# EAGLE schematic jdrange (EAGLE 9.6.2)
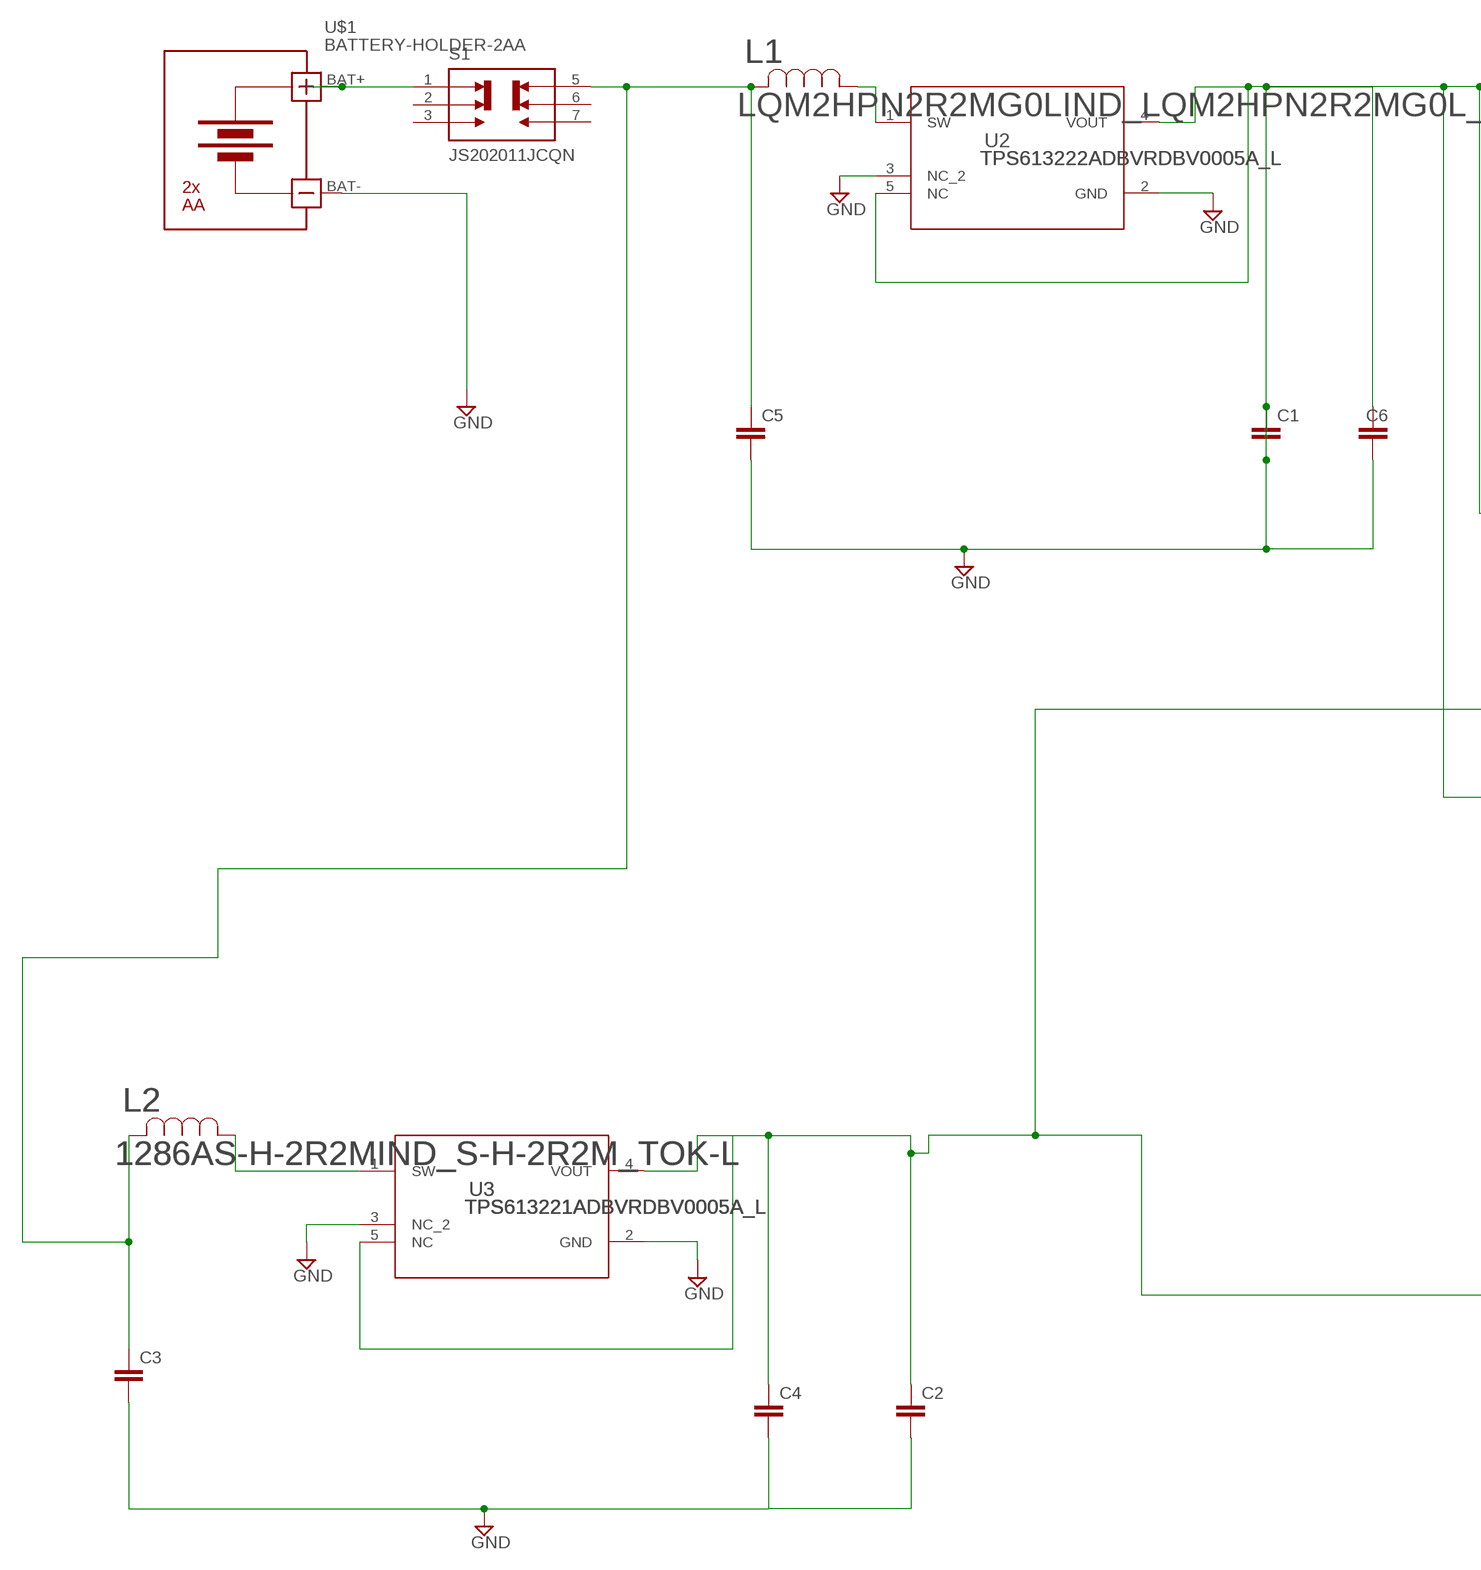
[diagram p0: schematic, sheet 1, part 1 of 2]
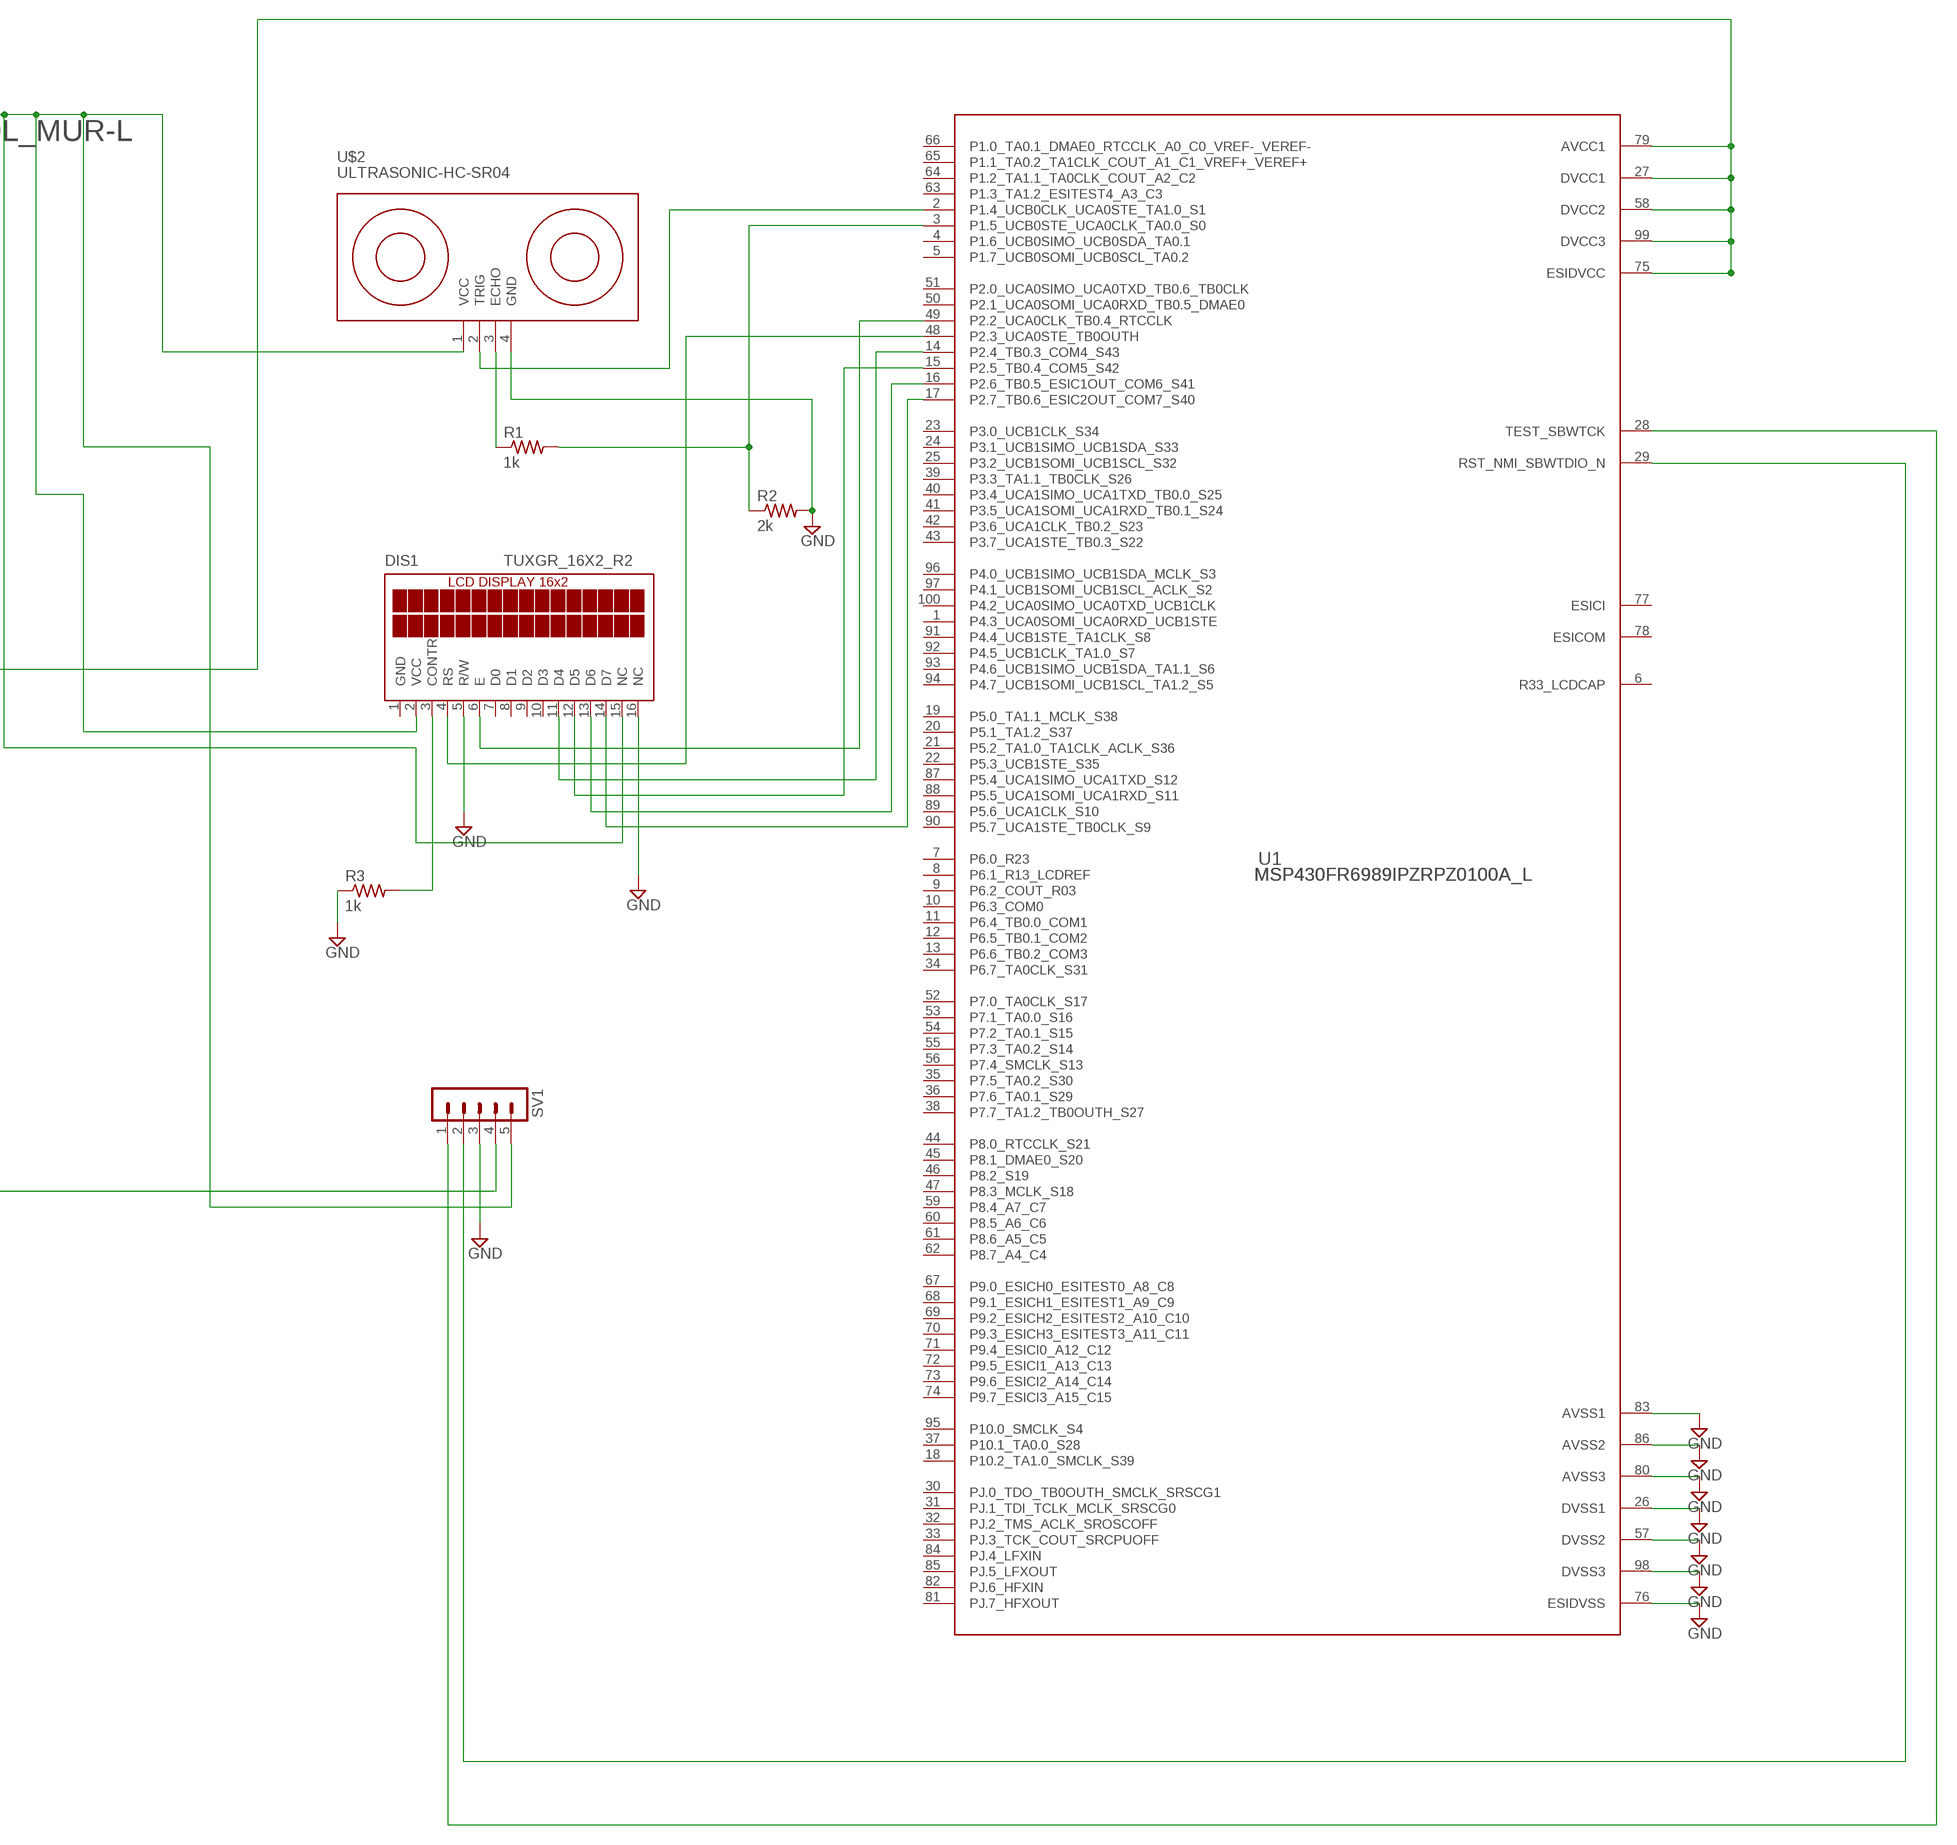
[diagram p1: schematic, sheet 1, part 2 of 2]

## Parts
C1  C-EUC0805  [C0805]
C2  C-EUC0805  [C0805]
C3  C-EUC0805  [C0805]
C4  C-EUC0805  [C0805]
C5  C-EUC0805  [C0805]
C6  C-EUC0805  [C0805]
DIS1  TUXGR_16X2_R2  [TUXGR_16X2_R2]
L1  LQM2HPN2R2MG0LIND_LQM2HPN2R2MG0L_MUR-L  [IND_LQM2HPN2R2MG0L_MUR-L]
L2  1286AS-H-2R2MIND_S-H-2R2M_TOK-L  [IND_S-H-2R2M_TOK-L]
R1  1k  R-US_R0805  [R0805]
R2  2k  R-US_R0805  [R0805]
R3  1k  R-US_R0805  [R0805]
S1  JS202011JCQN  [SW_JS202011JCQN]
SV1  MA05-1  [MA05-1]
U1  MSP430FR6989IPZRPZ0100A_L  [PZ0100A_L]
U2  TPS613222ADBVRDBV0005A_L  [DBV0005A_L]
U3  TPS613221ADBVRDBV0005A_L  [DBV0005A_L]
U$1  BATTERY-HOLDER-2AA  [BATTERY-HOLDER-2AA]
U$2  ULTRASONIC-HC-SR04  [ULTRASONIC-HC-SR04]

## Nets
GND: C1.1 C1.2 C2.2 C3.2 C4.2 C5.2 C6.1 C6.2 DIS1.2(VCC) DIS1.5(R/W) DIS1.15(NC) DIS1.16(NC) R2.2 R3.1 SV1.3 SV1.5 U1.26(DVSS1) U1.57(DVSS2) U1.76(ESIDVSS) U1.80(AVSS3) U1.83(AVSS1) U1.86(AVSS2) U1.98(DVSS3) U2.2(GND) U2.3(NC_2) U2.4(VOUT) U2.5(NC) U3.2(GND) U3.3(NC_2) U$1.BAT- U$2.1(VCC) U$2.4(GND)
N$1: C3.1 C5.1 L1.2 L2.2 S1.5
N$2: SV1.1 U1.28(TEST_SBWTCK)
N$3: U1.2(P1.4_UCB0CLK_UCA0STE_TA1.0_S1) U$2.2(TRIG)
N$4: L2.1 U3.1(SW)
N$5: L1.1 U2.1(SW)
N$6: R1.1 U$2.3(ECHO)
N$7: R1.2 R2.1 U1.3(P1.5_UCB0STE_UCA0CLK_TA0.0_S0)
N$8: SV1.2 U1.29(RST_NMI_SBWTDIO_N)
N$9: DIS1.6(E) U1.49(P2.2_UCA0CLK_TB0.4_RTCCLK)
N$10: DIS1.4(RS) U1.48(P2.3_UCA0STE_TB0OUTH)
N$11: DIS1.11(D4) U1.14(P2.4_TB0.3_COM4_S43)
N$12: DIS1.12(D5) U1.15(P2.5_TB0.4_COM5_S42)
N$13: DIS1.13(D6) U1.16(P2.6_TB0.5_ESIC1OUT_COM6_S41)
N$14: DIS1.3(CONTR) R3.2
N$15: DIS1.14(D7) U1.17(P2.7_TB0.6_ESIC2OUT_COM7_S40)
N$16: S1.1 U$1.BAT+
N$17: C2.1 C4.1 SV1.4 U1.27(DVCC1) U1.58(DVCC2) U1.75(ESIDVCC) U1.79(AVCC1) U1.99(DVCC3) U3.4(VOUT) U3.5(NC)
Unconnected: DIS1.7(D0) DIS1.8(D1) DIS1.9(D2) DIS1.10(D3) S1.2 S1.3 S1.6 S1.7 U1.1(P4.3_UCA0SOMI_UCA0RXD_UCB1STE) U1.4(P1.6_UCB0SIMO_UCB0SDA_TA0.1) U1.5(P1.7_UCB0SOMI_UCB0SCL_TA0.2) U1.6(R33_LCDCAP) U1.7(P6.0_R23) U1.8(P6.1_R13_LCDREF) U1.9(P6.2_COUT_R03) U1.10(P6.3_COM0) U1.11(P6.4_TB0.0_COM1) U1.12(P6.5_TB0.1_COM2) U1.13(P6.6_TB0.2_COM3) U1.18(P10.2_TA1.0_SMCLK_S39) U1.19(P5.0_TA1.1_MCLK_S38) U1.20(P5.1_TA1.2_S37) U1.21(P5.2_TA1.0_TA1CLK_ACLK_S36) U1.22(P5.3_UCB1STE_S35) U1.23(P3.0_UCB1CLK_S34) U1.24(P3.1_UCB1SIMO_UCB1SDA_S33) U1.25(P3.2_UCB1SOMI_UCB1SCL_S32) U1.30(PJ.0_TDO_TB0OUTH_SMCLK_SRSCG1) U1.31(PJ.1_TDI_TCLK_MCLK_SRSCG0) U1.32(PJ.2_TMS_ACLK_SROSCOFF) U1.33(PJ.3_TCK_COUT_SRCPUOFF) U1.34(P6.7_TA0CLK_S31) U1.35(P7.5_TA0.2_S30) U1.36(P7.6_TA0.1_S29) U1.37(P10.1_TA0.0_S28) U1.38(P7.7_TA1.2_TB0OUTH_S27) U1.39(P3.3_TA1.1_TB0CLK_S26) U1.40(P3.4_UCA1SIMO_UCA1TXD_TB0.0_S25) U1.41(P3.5_UCA1SOMI_UCA1RXD_TB0.1_S24) U1.42(P3.6_UCA1CLK_TB0.2_S23) U1.43(P3.7_UCA1STE_TB0.3_S22) U1.44(P8.0_RTCCLK_S21) U1.45(P8.1_DMAE0_S20) U1.46(P8.2_S19) U1.47(P8.3_MCLK_S18) U1.50(P2.1_UCA0SOMI_UCA0RXD_TB0.5_DMAE0) U1.51(P2.0_UCA0SIMO_UCA0TXD_TB0.6_TB0CLK) U1.52(P7.0_TA0CLK_S17) U1.53(P7.1_TA0.0_S16) U1.54(P7.2_TA0.1_S15) U1.55(P7.3_TA0.2_S14) U1.56(P7.4_SMCLK_S13) U1.59(P8.4_A7_C7) U1.60(P8.5_A6_C6) U1.61(P8.6_A5_C5) U1.62(P8.7_A4_C4) U1.63(P1.3_TA1.2_ESITEST4_A3_C3) U1.64(P1.2_TA1.1_TA0CLK_COUT_A2_C2) U1.65(P1.1_TA0.2_TA1CLK_COUT_A1_C1_VREF+_VEREF+) U1.66(P1.0_TA0.1_DMAE0_RTCCLK_A0_C0_VREF-_VEREF-) U1.67(P9.0_ESICH0_ESITEST0_A8_C8) U1.68(P9.1_ESICH1_ESITEST1_A9_C9) U1.69(P9.2_ESICH2_ESITEST2_A10_C10) U1.70(P9.3_ESICH3_ESITEST3_A11_C11) U1.71(P9.4_ESICI0_A12_C12) U1.72(P9.5_ESICI1_A13_C13) U1.73(P9.6_ESICI2_A14_C14) U1.74(P9.7_ESICI3_A15_C15) U1.77(ESICI) U1.78(ESICOM) U1.81(PJ.7_HFXOUT) U1.82(PJ.6_HFXIN) U1.84(PJ.4_LFXIN) U1.85(PJ.5_LFXOUT) U1.87(P5.4_UCA1SIMO_UCA1TXD_S12) U1.88(P5.5_UCA1SOMI_UCA1RXD_S11) U1.89(P5.6_UCA1CLK_S10) U1.90(P5.7_UCA1STE_TB0CLK_S9) U1.91(P4.4_UCB1STE_TA1CLK_S8) U1.92(P4.5_UCB1CLK_TA1.0_S7) U1.93(P4.6_UCB1SIMO_UCB1SDA_TA1.1_S6) U1.94(P4.7_UCB1SOMI_UCB1SCL_TA1.2_S5) U1.95(P10.0_SMCLK_S4) U1.96(P4.0_UCB1SIMO_UCB1SDA_MCLK_S3) U1.97(P4.1_UCB1SOMI_UCB1SCL_ACLK_S2) U1.100(P4.2_UCA0SIMO_UCA0TXD_UCB1CLK)

## Power pins joined to a net without a drawn wire
GND: DIS1.1(GND)

## Library data of the parts
C1-C6 = rcl:C-EU: CAPACITOR, European symbol; MF: KEMET; MPN: C0805C105K4RACTU; OC_NEWARK: 77C5351; SPICEPREFIX: C
DIS1 = display-lcd:TUXGR_16X2_R2: Tuxgraphics LCD display 16x2 characters reflective, without background light Source: tuxgr_12x2_r2.pdf; OC_FARNELL: unknown; OC_NEWARK: unknown
L1 = JD-RangeFinder:LQM2HPN2R2MG0L; COPYRIGHT: Copyright (C) 2022 Ultra Librarian. All rights reserved.; MANUFACTURER_PART_NUMBER: LQM2HPN2R2MG0L; MF: MURATA; MFR_NAME: Murata; MPN: LQM2HPN2R2MG0L; OC_NEWARK: 45Y5436
L2 = JD-RangeFinder:1286AS-H-2R2M; COPYRIGHT: Copyright (C) 2022 Ultra Librarian. All rights reserved.; MANUFACTURER_PART_NUMBER: 1286AS-H-2R2M; MFR_NAME: Toko; OC_NEWARK: unknown
R1-R3 = rcl:R-US_: RESISTOR, American symbol; OC_NEWARK: unknown; SPICEPREFIX: R
S1 = JS202011JCQN (1):JS202011JCQN: Slide Switch DPDT Surface Mount; DESCRIPTION: Slide Switch DPDT Surface Mount; DIGI-KEY_PART_NUMBER: CKN10723TR-ND; MF: C&K; MP: JS202011JCQN; OC_NEWARK: unknown; PACKAGE: DPDT-6 C&amp;K; PURCHASE-URL: https://pricing.snapeda.com/search/part/JS202011JCQN/?ref=eda
SV1 = con-lstb:MA05-1: PIN HEADER; OC_FARNELL: unknown; OC_NEWARK: unknown
U1 = JD-RangeFinder:MSP430FR6989IPZR; COPYRIGHT: Copyright (C) 2022 Ultra Librarian. All rights reserved.; MANUFACTURER_PART_NUMBER: MSP430FR6989IPZR; MFR_NAME: Texas Instruments; OC_NEWARK: unknown; REFDES: RefDes; TYPE: TYPE
U2 = JD-RangeFinder:TPS613222ADBVR; COPYRIGHT: Copyright (C) 2022 Ultra Librarian. All rights reserved.; MANUFACTURER_PART_NUMBER: TPS613222ADBVR; MFR_NAME: Texas Instruments; OC_NEWARK: unknown; REFDES: RefDes; TYPE: TYPE
U3 = JD-RangeFinder:TPS613221ADBVR; COPYRIGHT: Copyright (C) 2022 Ultra Librarian. All rights reserved.; MANUFACTURER_PART_NUMBER: TPS613221ADBVR; MFR_NAME: Texas Instruments; OC_NEWARK: unknown; REFDES: RefDes; TYPE: TYPE
U$1 = diy-modules:BATTERY-HOLDER-2AA: Battery Holder 2 x AA Click here to find device on ebay.com <http://www.ebay.com/sch/battery+plastic+holder+aa+2x1.5v>; OC_NEWARK: unknown
U$2 = diy-modules:ULTRASONIC-HC-SR04: Ultrasonic Ranging Module HC-SR04 More details available here: http://randomnerdtutorials.com/complete-guide-for-ultrasonic-sensor-hc-sr04/ Click here to find device on ebay.com <http://www.ebay.com/sch/hc+sr04+ultrasonic>; OC_NEWARK: unknown